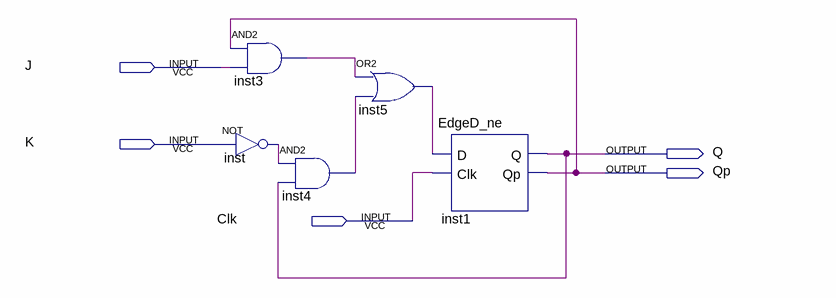
[diagram p0: schematic sheet]
// Quartus schematic jkff.bdf as structural Verilog: 5 symbols, 5 pins
module jkff (
  input  J,
  input  K,
  input  Clk,
  output Q,
  output Qp
);

  wire inst3_out, inst4_out, inst5_out, inst_out;

  and inst3 (inst3_out, Qp, J);
  not inst (inst_out, K);
  and inst4 (inst4_out, inst_out, Q);
  or inst5 (inst5_out, inst3_out, inst4_out);
  EdgeD_ne inst1 (.D(inst5_out), .Clk(Clk), .Q(Q), .Qp(Qp));
endmodule
